# EAGLE design 2te8LED (EAGLE 5.04)
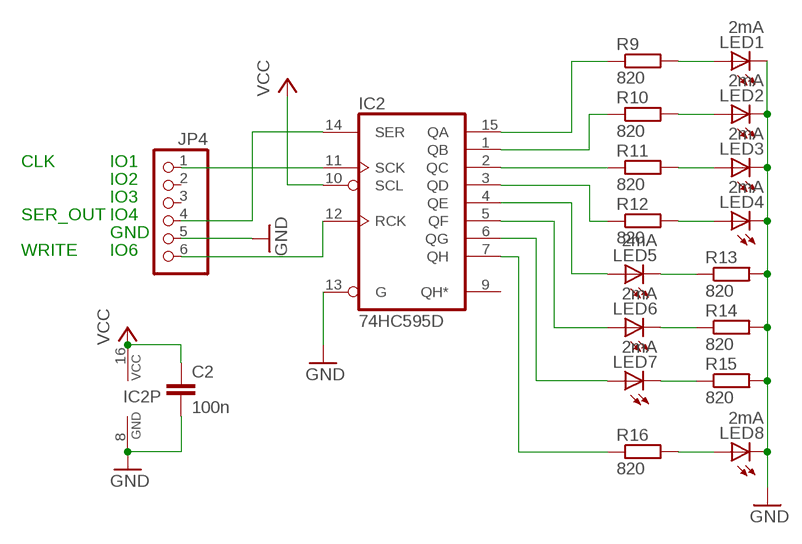
[diagram p0: schematic, sheet 1]

## Parts
C2  100n  C-EU050-024X044  [C050-024X044]
IC2  74HC595D  [SO16]
JP4  PINHD-1X6  [1X06]
LED1  2mA  LED3MM  [LED3MM]
LED2  2mA  LED3MM  [LED3MM]
LED3  2mA  LED3MM  [LED3MM]
LED4  2mA  LED3MM  [LED3MM]
LED5  2mA  LED3MM  [LED3MM]
LED6  2mA  LED3MM  [LED3MM]
LED7  2mA  LED3MM  [LED3MM]
LED8  2mA  LED3MM  [LED3MM]
R9  820  R-EU_0204/7  [0204/7]
R10  820  R-EU_0204/7  [0204/7]
R11  820  R-EU_0204/7  [0204/7]
R12  820  R-EU_0204/7  [0204/7]
R13  820  R-EU_0204/7  [0204/7]
R14  820  R-EU_0204/7  [0204/7]
R15  820  R-EU_0204/7  [0204/7]
R16  820  R-EU_0204/7  [0204/7]

## Nets
GND: C2.2 IC2.8(GND) IC2.13(G) JP4.5 LED1.K(C) LED2.K(C) LED3.K(C) LED4.K(C) LED8.K(C) R13.2 R14.2 R15.2
IO1: IC2.11(SCK) JP4.1
IO4: IC2.14(SER) JP4.4
IO6: IC2.12(RCK) JP4.6
N$20: IC2.15(QA) R9.1
N$21: IC2.1(QB) R10.1
N$22: IC2.2(QC) R11.1
N$23: IC2.3(QD) R12.1
N$24: IC2.4(QE) LED5.A
N$25: IC2.5(QF) LED6.A
N$26: IC2.6(QG) LED7.A
N$29: LED1.A R9.2
N$30: LED2.A R10.2
N$31: LED3.A R11.2
N$32: LED4.A R12.2
N$33: LED5.K(C) R13.1
N$34: LED6.K(C) R14.1
N$35: LED7.K(C) R15.1
N$36: IC2.7(QH) R16.1
N$37: LED8.A R16.2
VCC: C2.1 IC2.10(SCL) IC2.16(VCC)
Unconnected: IC2.9(QH*) JP4.2 JP4.3

## Notes on the sheet
- CLK | IO1
- IO2
- IO3
- SER_OUT | IO4
- GND
- WRITE | IO6

## Library data of the parts
C2 = rcl:C-EU: CAPACITOR, European symbol
IC2 = 74xx-eu:74*595: 8-bit SHIFT REGISTER, output latch
JP4 = pinhead:PINHD-1X6: PIN HEADER
LED1-LED8 = led:LED: LED OSRAM: - CHIPLED LG R971, LG N971, LY N971, LG Q971, LY Q971, LO R971, LY R971 LH N974, LH R974 LS Q976, LO Q976, LY Q976 LO Q996 - Hyper CHIPLED LW Q18S LB Q993, LB Q99A, LB R99A - SideLED LS A670, LO A670, LY A670, LG A670, LP A670 LB A673, LV A673, LT A673, LW A673 LH A674 LY A675 LS A676, LA A676, LO A676, LY A676, LW A676 LS A679, LY A679, LG A679 - Hyper Micro SIDELED® LS Y876, LA Y876, LO Y876, LY Y876 LT Y87S - SmartLED LW L88C, LW L88S LB L89C, LB L89S, LG L890 LS L89K, LO L89K, LY L89K LS L896, LA L896, LO L896, LY L896 - TOPLED LS T670, LO T670, LY T670, LG T670, LP T670 LSG T670, LSP T670, LSY T670, LOP T670, LYG T670 LG T671, LOG T671, LSG T671 LB T673, LV T673, LT T673, LW T673 LH T674 LS T676, LA T676, LO T676, LY T676, LB T676, LH T676, LSB T676, LW T676 LB T67C, LV T67C, LT T67C, LS T67K, LO T67K, LY T67K, LW E67C LS E67B, LA E67B, LO E67B, LY E67B, LB E67C, LV E67C, LT E67C LW T67C LS T679, LY T679, LG T679 LS T770, LO T770, LY T770, LG T770, LP T770 LB T773, LV T773, LT T773, LW T773 LH T774 LS E675, LA E675, LY E675, LS T675 LS T776, LA T776, LO T776, LY T776, LB T776 LHGB T686 LT T68C, LB T68C - Hyper Mini TOPLED® LB M676 - Mini TOPLED Santana® LG M470 LS M47K, LO M47K, LY M47K Source: http://www.osram.convergy.de - LUMILED® LXK2-PW12-R00, LXK2-PW12-S00, LXK2-PW14-U00, LXK2-PW14-V00 LXK2-PM12-R00, LXK2-PM12-S00, LXK2-PM14-U00 LXK2-PE12-Q00, LXK2-PE12-R00, LXK2-PE12-S00, LXK2-PE14-T00, LXK2-PE14-U00 LXK2-PB12-K00, LXK2-PB12-L00, LXK2-PB12-M00, LXK2-PB14-N00, LXK2-PB14-P00, LXK2-PB14-Q00 LXK2-PR12-L00, LXK2-PR12-M00, LXK2-PR14-Q00, LXK2-PR14-R00 LXK2-PD12-Q00, LXK2-PD12-R00, LXK2-PD12-S00 LXK2-PH12-R00, LXK2-PH12-S00 LXK2-PL12-P00, LXK2-PL12-Q00, LXK2-PL12-R00 Source: www.luxeon.com
R9-R16 = rcl:R-EU_: RESISTOR, European symbol

## Board
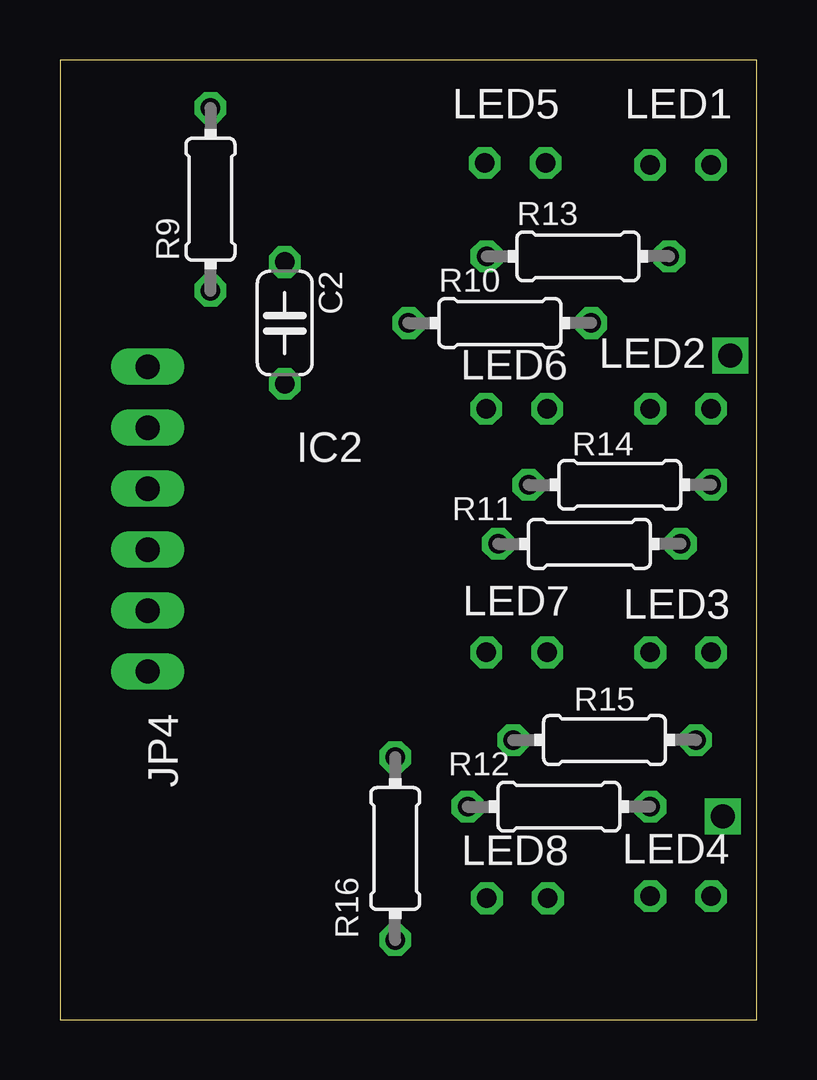
[diagram p1: board, top side]
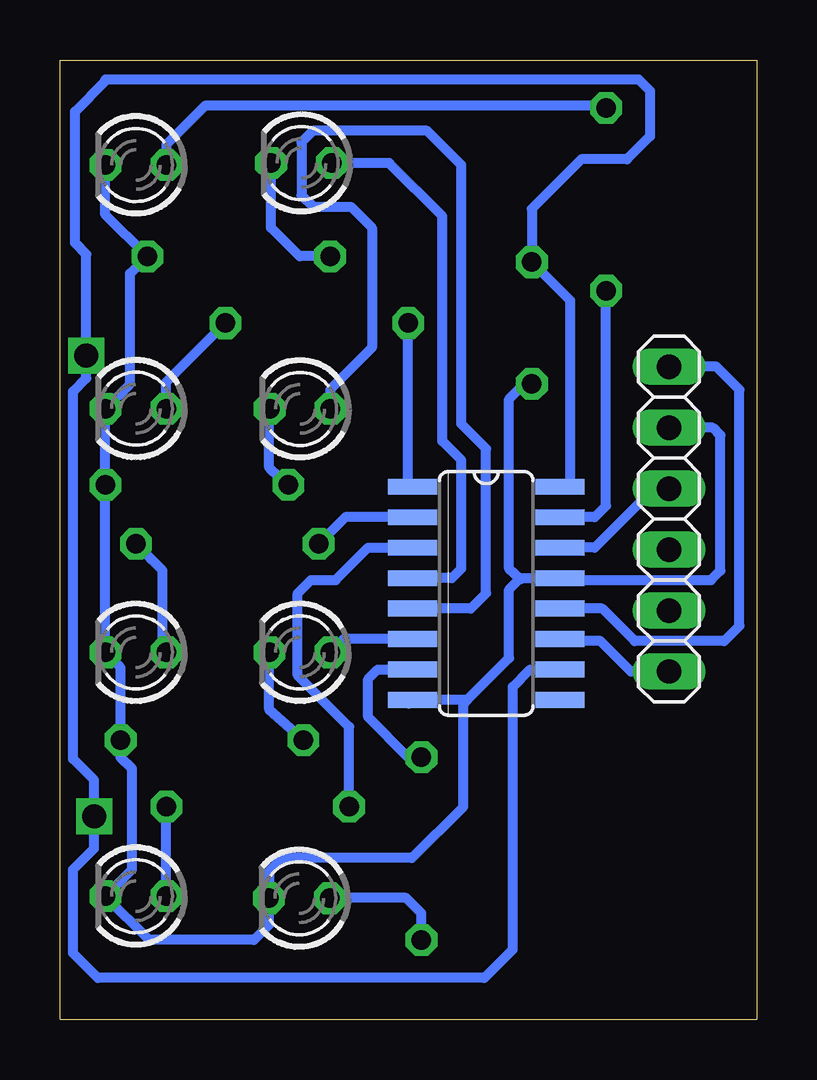
[diagram p2: board, bottom side, seen from below]

Size 29.05 x 40 mm. Coordinates in mm from the lower left corner, seen from the top.
Outline: 29.05,40 0,40
Outline: 0,40 0,0
Outline: 0,0 29.04,0
Outline: 29.04,0 29.04,40
Copper layers (1*16): Top 0.035mm / dielectric 1.5mm / Bottom 0.035mm
Design rules "default": minimum track width 10mil, minimum drill 24mil, track to track 8mil, track to pad 8mil, pad to pad 8mil, via to via 8mil, smd to smd 8mil, copper to edge 40mil, drill to drill 8mil, minimum pad ring 10mil, minimum via ring 8mil, stop-mask expansion 4mil, vias tented up to drill 0mil, thermal gap 10mil

### Footprints (pad centres in the part's own frame; a part is rotated, then mirrored left to right if it is on the bottom)
C050-024X044 = drill 0.813 octagon: 1 -2.54,0; 2 2.54,0
SO16 = smd 0.66 x 2.032: 1 -4.445,-3.073; 2 -3.175,-3.073; 3 -1.905,-3.073; 4 -0.635,-3.073; 5 0.635,-3.073; 6 1.905,-3.073; 7 3.175,-3.073; 8 4.445,-3.073; 9 4.445,3.073; 10 3.175,3.073; 11 1.905,3.073; 12 0.635,3.073; 13 -0.635,3.073; 14 -1.905,3.073; 15 -3.175,3.073; 16 -4.445,3.073
1X06 = drill 1.016 long: 1 -6.35,0; 2 -3.81,0; 3 -1.27,0; 4 1.27,0; 5 3.81,0; 6 6.35,0
LED3MM = drill 0.813 octagon: A -1.27,0; K 1.27,0
0204/7 = drill 0.813 octagon: 1 -3.81,0; 2 3.81,0

### Placement (x,y rotation side)
C2  9.37,29.03 270 top
IC2  11.28,17.76 270 bottom
JP4  3.66,20.86 90 bottom
LED1  25.88,35.62 180 bottom
LED2  25.88,25.46 180 bottom
LED3  25.88,15.3 180 bottom
LED4  25.88,5.14 180 bottom
LED5  18.98,35.7 180 bottom
LED6  19.04,25.45 180 bottom
LED7  19.05,15.3 180 bottom
LED8  19.07,5.06 180 bottom
R9  6.28,34.19 90 top
R10  18.34,29.03 0 top
R11  22.07,19.83 0 top
R12  20.8,8.87 0 top
R13  21.6,31.81 0 top
R14  23.34,22.29 0 top
R15  22.71,11.65 0 top
R16  13.98,7.13 270 top

### Tracks (layer width: path | path; a pad name or v marks a point on that pad's centre or on a via)
GND
  Bottom 0.406: JP4.5 1.83,24.67 1.51,24.35 1.51,18.72 1.91,18.32 8.12,18.32 IC2.13 9.85,18.4 9.89,18.36 | 14.51,13.16 IC2.8 12.07,13.32 | 12.07,13.32 10.32,15.06 10.32,17.92 9.89,18.36 | LED2.K 26.12,26.49 26.12,31.1 R13.2 27.15,33.56 LED1.K | LED2.K | LED2.K 27.15,25.38 27.15,23.72 27.15,23.64 R14.2 LED3.K 26.52,14.67 R15.2 26.52,10.94 26.04,10.46 26.04,6.25 LED4.K 25.33,3.32 20.96,3.32 20.32,3.95 20.32,5.04 LED8.K 20.32,5.07 20.32,6.17 19.77,6.73 14.37,6.73 12.23,8.87 12.23,13.16 12.07,13.32 | 9.89,18.36 9.85,18.36 10.32,18.8 10.32,25.86 9.85,26.34 9.53,26.34 C2.2
IO1
  Bottom 0.406: JP4.1 5.24,14.51 6.51,15.78 8.12,15.78 IC2.11
IO4
  Bottom 0.406: JP4.4 4.29,22.13 6.75,19.67 IC2.14
IO6
  Bottom 0.406: JP4.6 1.67,27.21 0.72,26.26 0.72,16.41 1.35,15.78 5.08,15.78 6.43,17.13 IC2.12
N$20
  Bottom 0.406: IC2.15 6.75,20.94 6.28,21.41 R9.1
N$21
  Bottom 0.406: R10.1 14.53,22.39 IC2.1
N$22
  Bottom 0.406: R11.1 17.86,20.22 17.15,20.94 IC2.2
N$23
  Bottom 0.406: R12.1 16.99,12.21 19.13,14.35 19.13,17.76 18.58,18.32 17.55,18.32 16.2,19.67 IC2.3
N$24
  Bottom 0.406: LED5.A 15.32,35.7 13.1,33.48 13.1,24.11 12.31,23.32 12.31,18.8 12.7,18.4 IC2.4
N$25
  Bottom 0.406: IC2.5 11.91,17.13 11.28,17.76 11.28,23.8 12.31,24.83 12.31,35.62 13.74,37.05 18.5,37.05 18.98,36.58 18.98,34.35 18.5,33.88 16.91,33.88 16.04,33 16.04,28 17.78,26.26 17.78,25.47 LED6.A
N$26
  Bottom 0.406: IC2.6 17.23,15.86 17.23,15.85 LED7.A
N$29
  Bottom 0.406: R9.2 6.28,38.08 23,38.08 24.62,36.46 LED1.A
N$30
  Bottom 0.406: R10.2 24.61,26.57 LED2.A
N$31
  Bottom 0.406: LED3.A 24.77,15.46 24.77,18.72 25.25,19.19 R11.2
N$32
  Bottom 0.406: LED4.A R12.2
N$33
  Bottom 0.406: LED5.K 20.25,33 19.05,31.81 17.94,31.81 R13.1
N$34
  Bottom 0.406: 20.25,22.92 20.32,23 20.32,25.43 LED6.K | 20.25,22.92 | R14.1 20.25,22.92
N$35
  Bottom 0.406: R15.1 20.32,12.92 LED7.K
N$36
  Bottom 0.406: IC2.7 15.8,14.59 16.2,14.19 16.2,12.6 14.53,10.94 R16.1
N$37
  Bottom 0.406: R16.2 13.97,4.43 14.61,5.06 LED8.A
VCC  (via drill 1 pad 1.42)
  Bottom 0.406: IC2.10 9.45,14.59 10.16,13.87 10.16,2.92 11.36,1.73 27.47,1.73 28.5,2.76 28.5,6.25 27.63,7.13 v27.63,8.48 27.63,9.98 28.5,10.86 28.5,26.18 27.94,26.73 v27.94,27.69 27.94,31.89 28.42,32.37 28.42,37.85 27.15,39.12 27.15,39.19 4.93,39.19 4.45,38.72 4.45,36.81 5.4,35.86 7.31,35.86 9.37,33.8 C2.1 | IC2.16 7.78,22.21 7.78,25.86 | C2.1 | 7.78,25.86 | C2.1 7.78,29.99 7.78,25.86